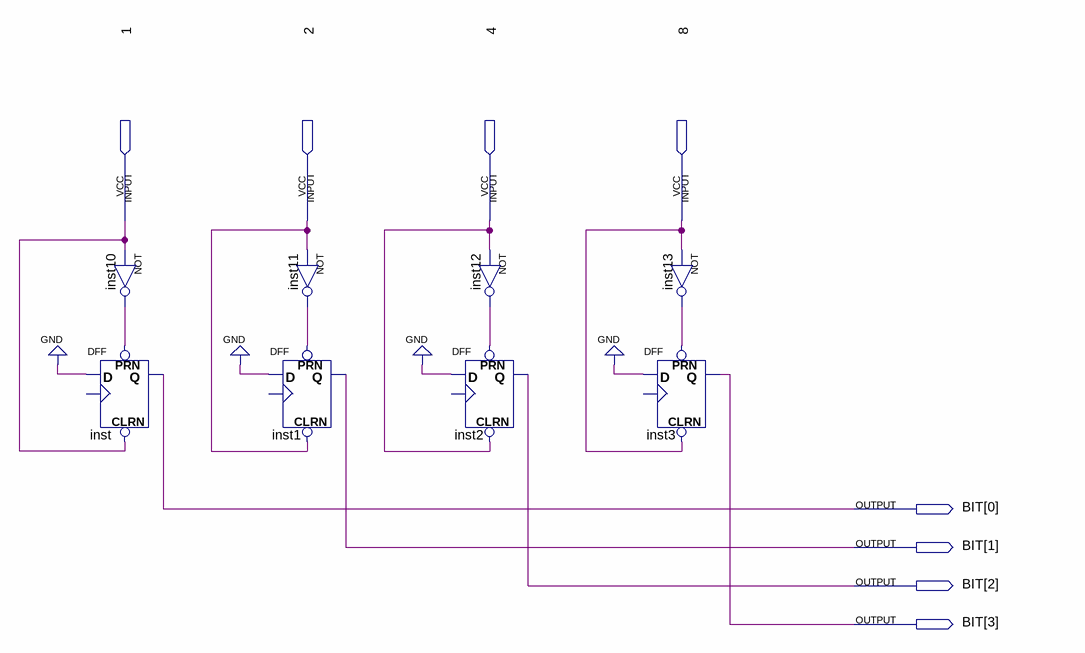
[diagram p0: schematic sheet]
// Quartus schematic registrador.bdf as structural Verilog: 8 symbols, 8 pins
module registrador (
  input  \1 ,
  input  \2 ,
  input  \4 ,
  input  \8 ,
  output [3:0] BIT
);

  wire inst10_out, inst11_out, inst12_out, inst13_out;

  not inst10 (inst10_out, \1 );
  DFF inst (.CLRN(\1 ), .D(1'b0), .PRN(inst10_out), .Q(BIT[0]));  // open: CLK
  not inst11 (inst11_out, \2 );
  DFF inst1 (.CLRN(\2 ), .D(1'b0), .PRN(inst11_out), .Q(BIT[1]));  // open: CLK
  not inst12 (inst12_out, \4 );
  DFF inst2 (.CLRN(\4 ), .D(1'b0), .PRN(inst12_out), .Q(BIT[2]));  // open: CLK
  not inst13 (inst13_out, \8 );
  DFF inst3 (.CLRN(\8 ), .D(1'b0), .PRN(inst13_out), .Q(BIT[3]));  // open: CLK
endmodule
